# EAGLE schematic MCB-Quectel-BG96-v1.0.0 (EAGLE 7.7.0)

## Sheet 1 of 4
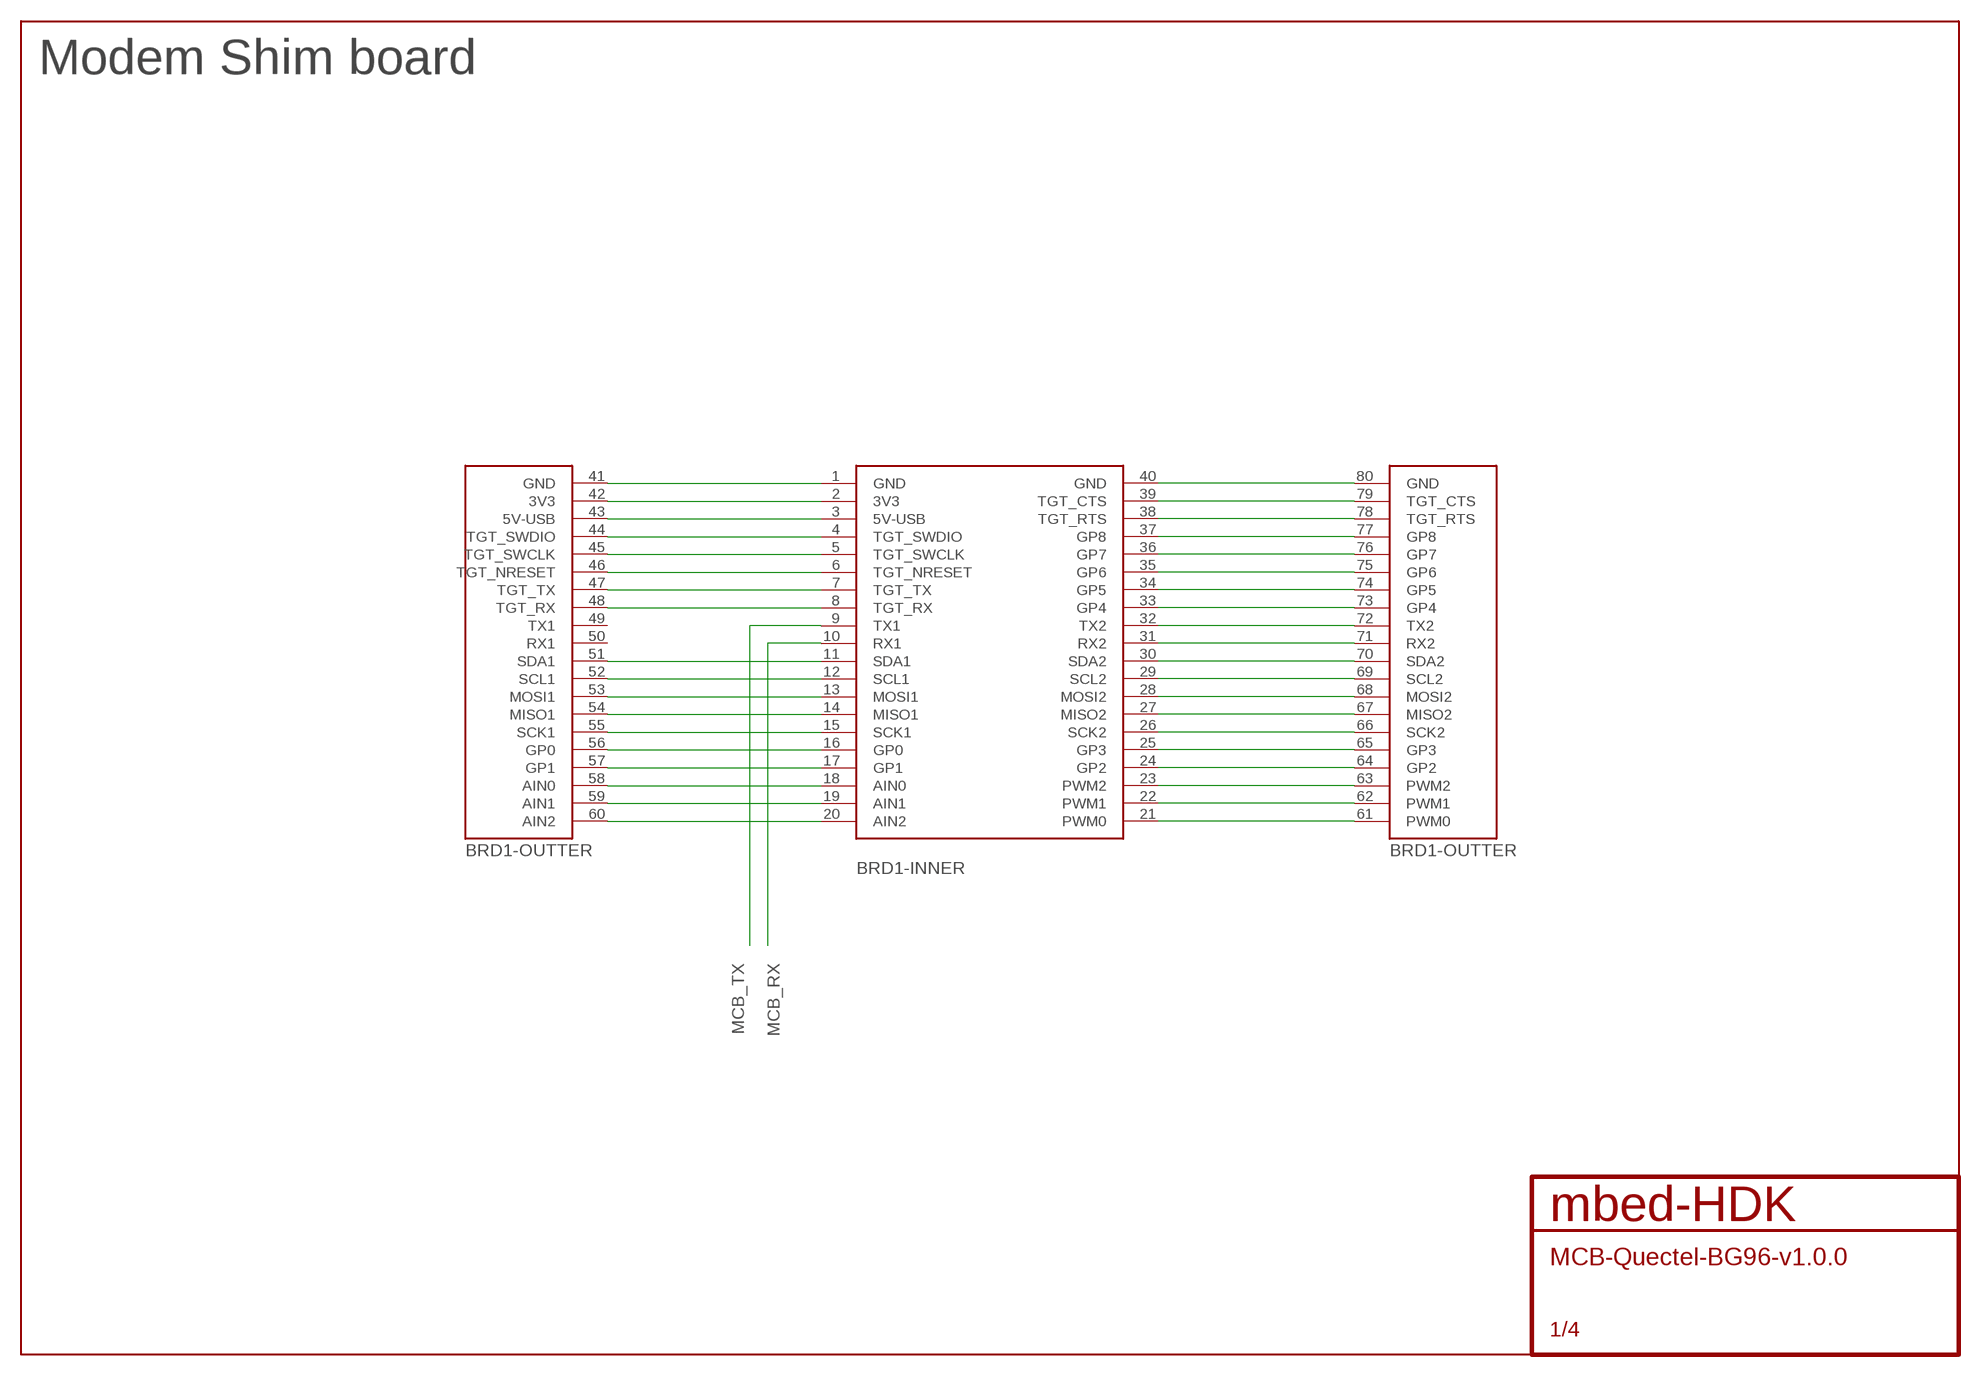
[diagram p0: schematic, sheet 1]

### Parts
BRD1  MODULE-SHIM-BRD  [MODULE-SHIM-BOARD]

### Nets
MCB_RX: BRD1.10(-INNER:RX1)
MCB_TX: BRD1.9(-INNER:TX1)
N$1: BRD1.40(-INNER:GND) BRD1.80(-OUTTER:GND)
N$2: BRD1.39(-INNER:TGT_CTS) BRD1.79(-OUTTER:TGT_CTS)
N$3: BRD1.38(-INNER:TGT_RTS) BRD1.78(-OUTTER:TGT_RTS)
N$4: BRD1.37(-INNER:GP8) BRD1.77(-OUTTER:GP8)
N$5: BRD1.36(-INNER:GP7) BRD1.76(-OUTTER:GP7)
N$6: BRD1.35(-INNER:GP6) BRD1.75(-OUTTER:GP6)
N$7: BRD1.34(-INNER:GP5) BRD1.74(-OUTTER:GP5)
N$8: BRD1.33(-INNER:GP4) BRD1.73(-OUTTER:GP4)
N$9: BRD1.32(-INNER:TX2) BRD1.72(-OUTTER:TX2)
N$10: BRD1.31(-INNER:RX2) BRD1.71(-OUTTER:RX2)
N$11: BRD1.30(-INNER:SDA2) BRD1.70(-OUTTER:SDA2)
N$12: BRD1.29(-INNER:SCL2) BRD1.69(-OUTTER:SCL2)
N$13: BRD1.28(-INNER:MOSI2) BRD1.68(-OUTTER:MOSI2)
N$14: BRD1.27(-INNER:MISO2) BRD1.67(-OUTTER:MISO2)
N$15: BRD1.26(-INNER:SCK2) BRD1.66(-OUTTER:SCK2)
N$16: BRD1.25(-INNER:GP3) BRD1.65(-OUTTER:GP3)
N$17: BRD1.24(-INNER:GP2) BRD1.64(-OUTTER:GP2)
N$18: BRD1.23(-INNER:PWM2) BRD1.63(-OUTTER:PWM2)
N$19: BRD1.22(-INNER:PWM1) BRD1.62(-OUTTER:PWM1)
N$20: BRD1.21(-INNER:PWM0) BRD1.61(-OUTTER:PWM0)
N$21: BRD1.1(-INNER:GND) BRD1.41(-OUTTER:GND)
N$22: BRD1.2(-INNER:3V3) BRD1.42(-OUTTER:3V3)
N$23: BRD1.3(-INNER:5V-USB) BRD1.43(-OUTTER:5V-USB)
N$24: BRD1.4(-INNER:TGT_SWDIO) BRD1.44(-OUTTER:TGT_SWDIO)
N$25: BRD1.5(-INNER:TGT_SWCLK) BRD1.45(-OUTTER:TGT_SWCLK)
N$26: BRD1.6(-INNER:TGT_NRESET) BRD1.46(-OUTTER:TGT_NRESET)
N$27: BRD1.7(-INNER:TGT_TX) BRD1.47(-OUTTER:TGT_TX)
N$28: BRD1.8(-INNER:TGT_RX) BRD1.48(-OUTTER:TGT_RX)
N$31: BRD1.11(-INNER:SDA1) BRD1.51(-OUTTER:SDA1)
N$32: BRD1.12(-INNER:SCL1) BRD1.52(-OUTTER:SCL1)
N$33: BRD1.13(-INNER:MOSI1) BRD1.53(-OUTTER:MOSI1)
N$34: BRD1.14(-INNER:MISO1) BRD1.54(-OUTTER:MISO1)
N$35: BRD1.15(-INNER:SCK1) BRD1.55(-OUTTER:SCK1)
N$36: BRD1.16(-INNER:GP0) BRD1.56(-OUTTER:GP0)
N$37: BRD1.17(-INNER:GP1) BRD1.57(-OUTTER:GP1)
N$38: BRD1.18(-INNER:AIN0) BRD1.58(-OUTTER:AIN0)
N$39: BRD1.19(-INNER:AIN1) BRD1.59(-OUTTER:AIN1)
N$40: BRD1.20(-INNER:AIN2) BRD1.60(-OUTTER:AIN2)
Unconnected: BRD1.49(-OUTTER:TX1) BRD1.50(-OUTTER:RX1)

### Notes on the sheet
- Modem Shim board

## Sheet 2 of 4
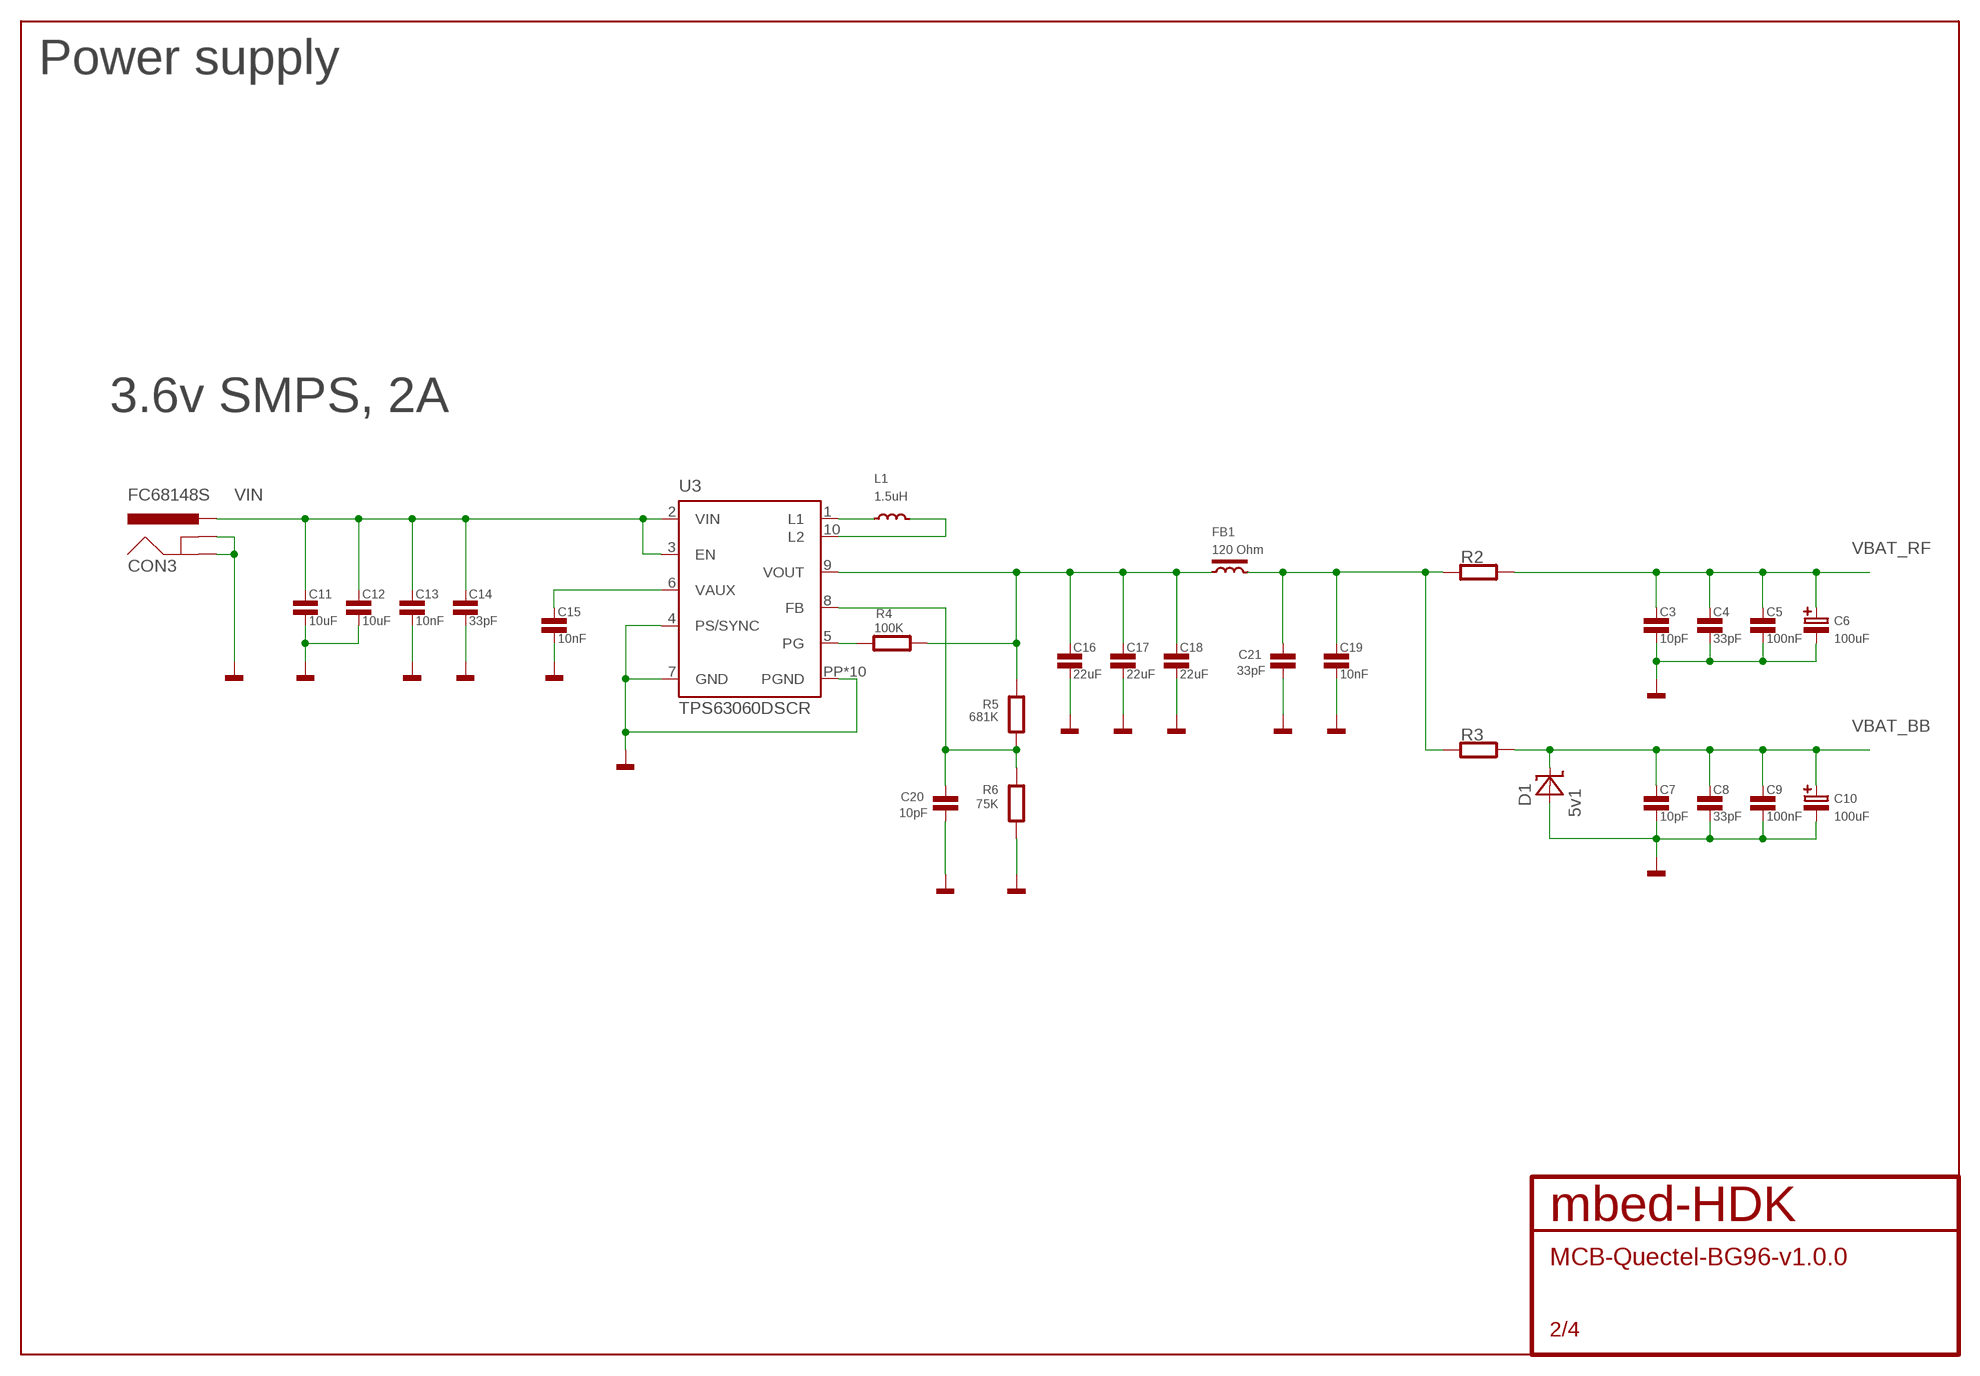
[diagram p1: schematic, sheet 2]

### Parts
C3  10pF  C0603  [0603]
C4  33pF  C0603  [0603]
C5  100nF  C0603  [0603]
C6  100uF  C-POLA  [SMC_A]
C7  10pF  C0603  [0603]
C8  33pF  C0603  [0603]
C9  100nF  C0603  [0603]
C10  100uF  C-POLA  [SMC_A]
C11  10uF  C0603  [0603]
C12  10uF  C0603  [0603]
C13  10nF  C0603  [0603]
C14  33pF  C0603  [0603]
C15  10nF  C0603  [0603]
C16  22uF  C0603  [0603]
C17  22uF  C0603  [0603]
C18  22uF  C0603  [0603]
C19  10nF  C0603  [0603]
C20  10pF  C0603  [0603]
C21  33pF  C0603  [0603]
CON3  FC68148S  [FC68148S]
D1  5v1  DIODE-ZENER  [SOD123]
FB1  120 Ohm  FB0603  [0603]
L1  1.5uH  INDUCTORXFL4020  [XFL4020-472MEC]
R2  R0603  [0603]
R3  R0603  [0603]
R4  100K  R0603  [0603]
R5  681K  R0603  [0603]
R6  75K  R0603  [0603]
U3  TPS63060DSCR  [DSC-S-PWSON-N10]

### Nets
GND: C3.2 C4.2 C5.2 C6.- C7.2 C8.2 C9.2 C10.- C11.2 C12.2 C13.2 C14.2 C15.2 C16.2 C17.2 C18.2 C19.2 C20.2 C21.2 CON3.2(GNDBREAK) CON3.3(GND) D1.1(A) R6.1 U3.4(PS/SYNC) U3.7(GND) U3.PP(PGND) U3.PP@1(PGND) U3.PP@2(PGND) U3.PP@3(PGND) U3.PP@4(PGND) U3.PP@5(PGND) U3.PP@7(PGND) U3.PP@8(PGND) U3.PP@9(PGND) U3.PP@10(PGND) ; also sheet 3
N$41: C15.1 U3.6(VAUX)
N$42: C19.1 C21.1 FB1.2 R2.1 R3.1
N$43: L1.P$1 U3.1(L1)
N$45: L1.P$2 U3.10(L2)
N$46: C16.1 C17.1 C18.1 FB1.1 R4.2 R5.2 U3.9(VOUT)
N$47: R4.1 U3.5(PG)
N$48: C20.1 R5.1 R6.2 U3.8(FB)
VBAT_BB: C7.1 C8.1 C9.1 C10.+ D1.2(C) R3.2 ; also sheet 3
VBAT_RF: C3.1 C4.1 C5.1 C6.+ R2.2 ; also sheet 3
VIN: C11.1 C12.1 C13.1 C14.1 CON3.1-1(PWR) CON3.1-2(PWR) U3.2(VIN) U3.3(EN)

### Notes on the sheet
- Power supply
- 3.6v SMPS, 2A

## Sheet 3 of 4
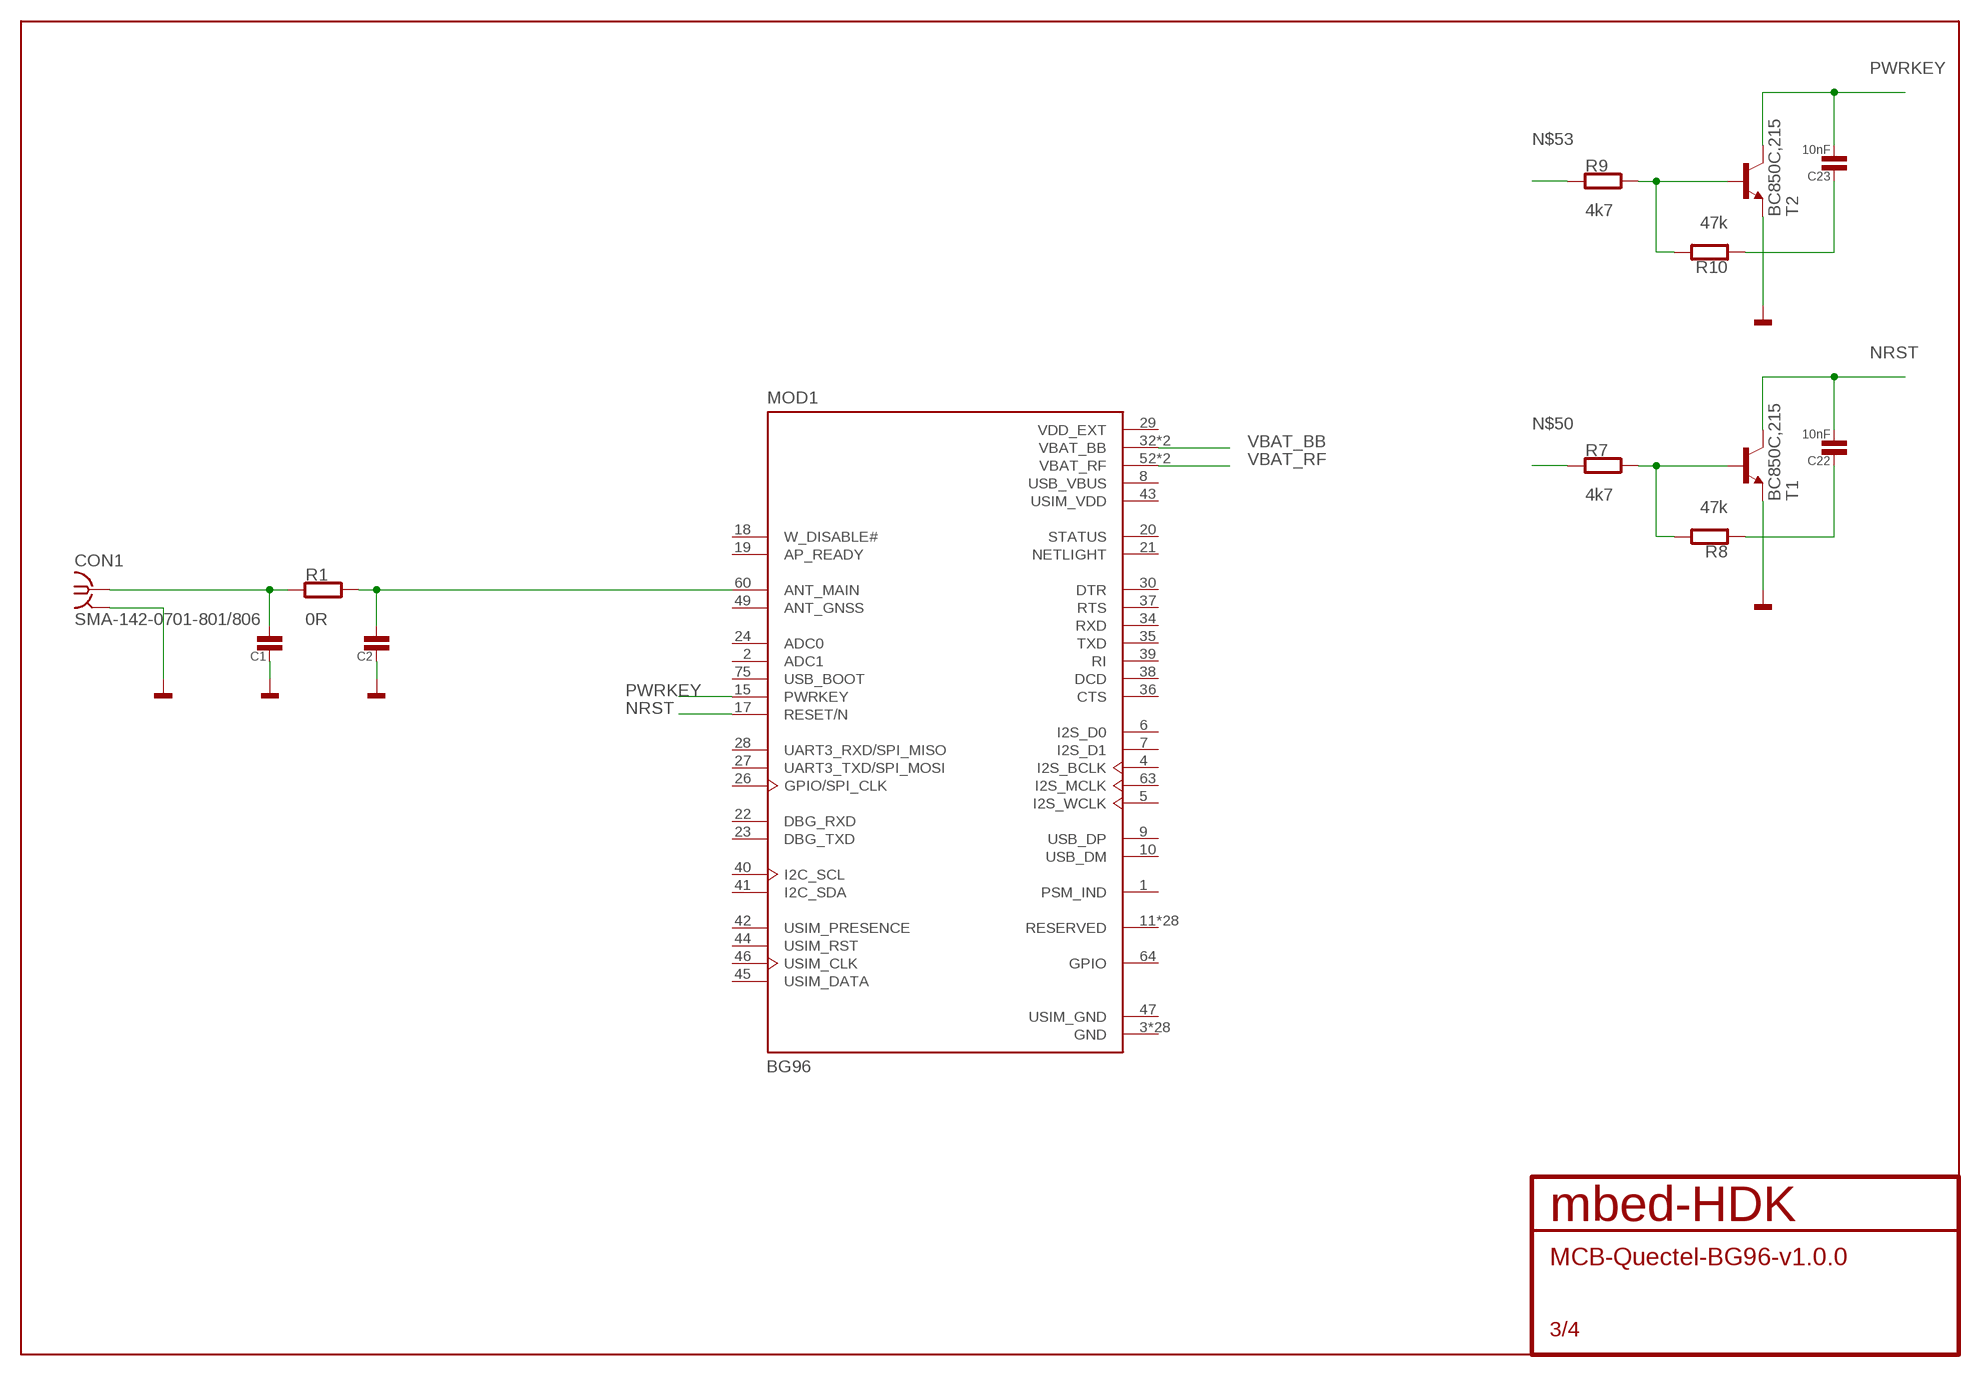
[diagram p2: schematic, sheet 3]

### Parts
C1  C0603  [0603]
C2  C0603  [0603]
C22  10nF  C0603  [0603]
C23  10nF  C0603  [0603]
CON1  SMA-142-0701-801/806  [J502-ND-142-0701-801/806]
MOD1  BG96  [LTE_MODULE_BG96]
R1  0R  R0603  [0603]
R7  4k7  R0603  [0603]
R8  47k  R0603  [0603]
R9  4k7  R0603  [0603]
R10  47k  R0603  [0603]
T1  BC850C,215  [SOT23-3]
T2  BC850C,215  [SOT23-3]

### Nets
GND: C1.1 C2.1 C22.1 C23.1 CON1.G@1 CON1.G@2 CON1.G@3 CON1.G@4 R8.1 R10.1 T1.2(E) T2.2(E) ; also sheet 2
N$29: C1.2 CON1.1 R1.1
N$30: C2.2 MOD1.60(ANT_MAIN) R1.2
N$49: R7.2 R8.2 T1.1(B)
N$50: R7.1
N$52: R9.2 R10.2 T2.1(B)
N$53: R9.1
NRST: C22.2 MOD1.17(RESET/N) T1.3(C)
PWRKEY: C23.2 MOD1.15(PWRKEY) T2.3(C)
VBAT_BB: MOD1.32(VBAT_BB) MOD1.33(VBAT_BB) ; also sheet 2
VBAT_RF: MOD1.52(VBAT_RF) MOD1.53(VBAT_RF) ; also sheet 2
Unconnected: MOD1.1(PSM_IND) MOD1.2(ADC1) MOD1.4(I2S_BCLK) MOD1.5(I2S_WCLK) MOD1.6(I2S_D0) MOD1.7(I2S_D1) MOD1.9(USB_DP) MOD1.10(USB_DM) MOD1.11(RESERVED) MOD1.12(RESERVED) MOD1.13(RESERVED) MOD1.14(RESERVED) MOD1.16(RESERVED) MOD1.18(W_DISABLE#) MOD1.19(AP_READY) MOD1.20(STATUS) MOD1.21(NETLIGHT) MOD1.22(DBG_RXD) MOD1.23(DBG_TXD) MOD1.24(ADC0) MOD1.25(RESERVED) MOD1.26(GPIO/SPI_CLK) MOD1.27(UART3_TXD/SPI_MOSI) MOD1.28(UART3_RXD/SPI_MISO) MOD1.30(DTR) MOD1.34(RXD) MOD1.35(TXD) MOD1.36(CTS) MOD1.37(RTS) MOD1.38(DCD) MOD1.39(RI) MOD1.40(I2C_SCL) MOD1.41(I2C_SDA) MOD1.42(USIM_PRESENCE) MOD1.44(USIM_RST) MOD1.45(USIM_DATA) MOD1.46(USIM_CLK) MOD1.49(ANT_GNSS) MOD1.51(RESERVED) MOD1.56(RESERVED) MOD1.57(RESERVED) MOD1.63(I2S_MCLK) MOD1.64(GPIO) MOD1.65(RESERVED) MOD1.66(RESERVED) MOD1.75(USB_BOOT) MOD1.76(RESERVED) MOD1.77(RESERVED) MOD1.78(RESERVED) MOD1.83(RESERVED) MOD1.84(RESERVED) MOD1.85(RESERVED) MOD1.86(RESERVED) MOD1.87(RESERVED) MOD1.88(RESERVED) MOD1.92(RESERVED) MOD1.93(RESERVED) MOD1.94(RESERVED) MOD1.95(RESERVED) MOD1.96(RESERVED) MOD1.97(RESERVED) MOD1.98(RESERVED) MOD1.99(RESERVED)

## Sheet 4 of 4
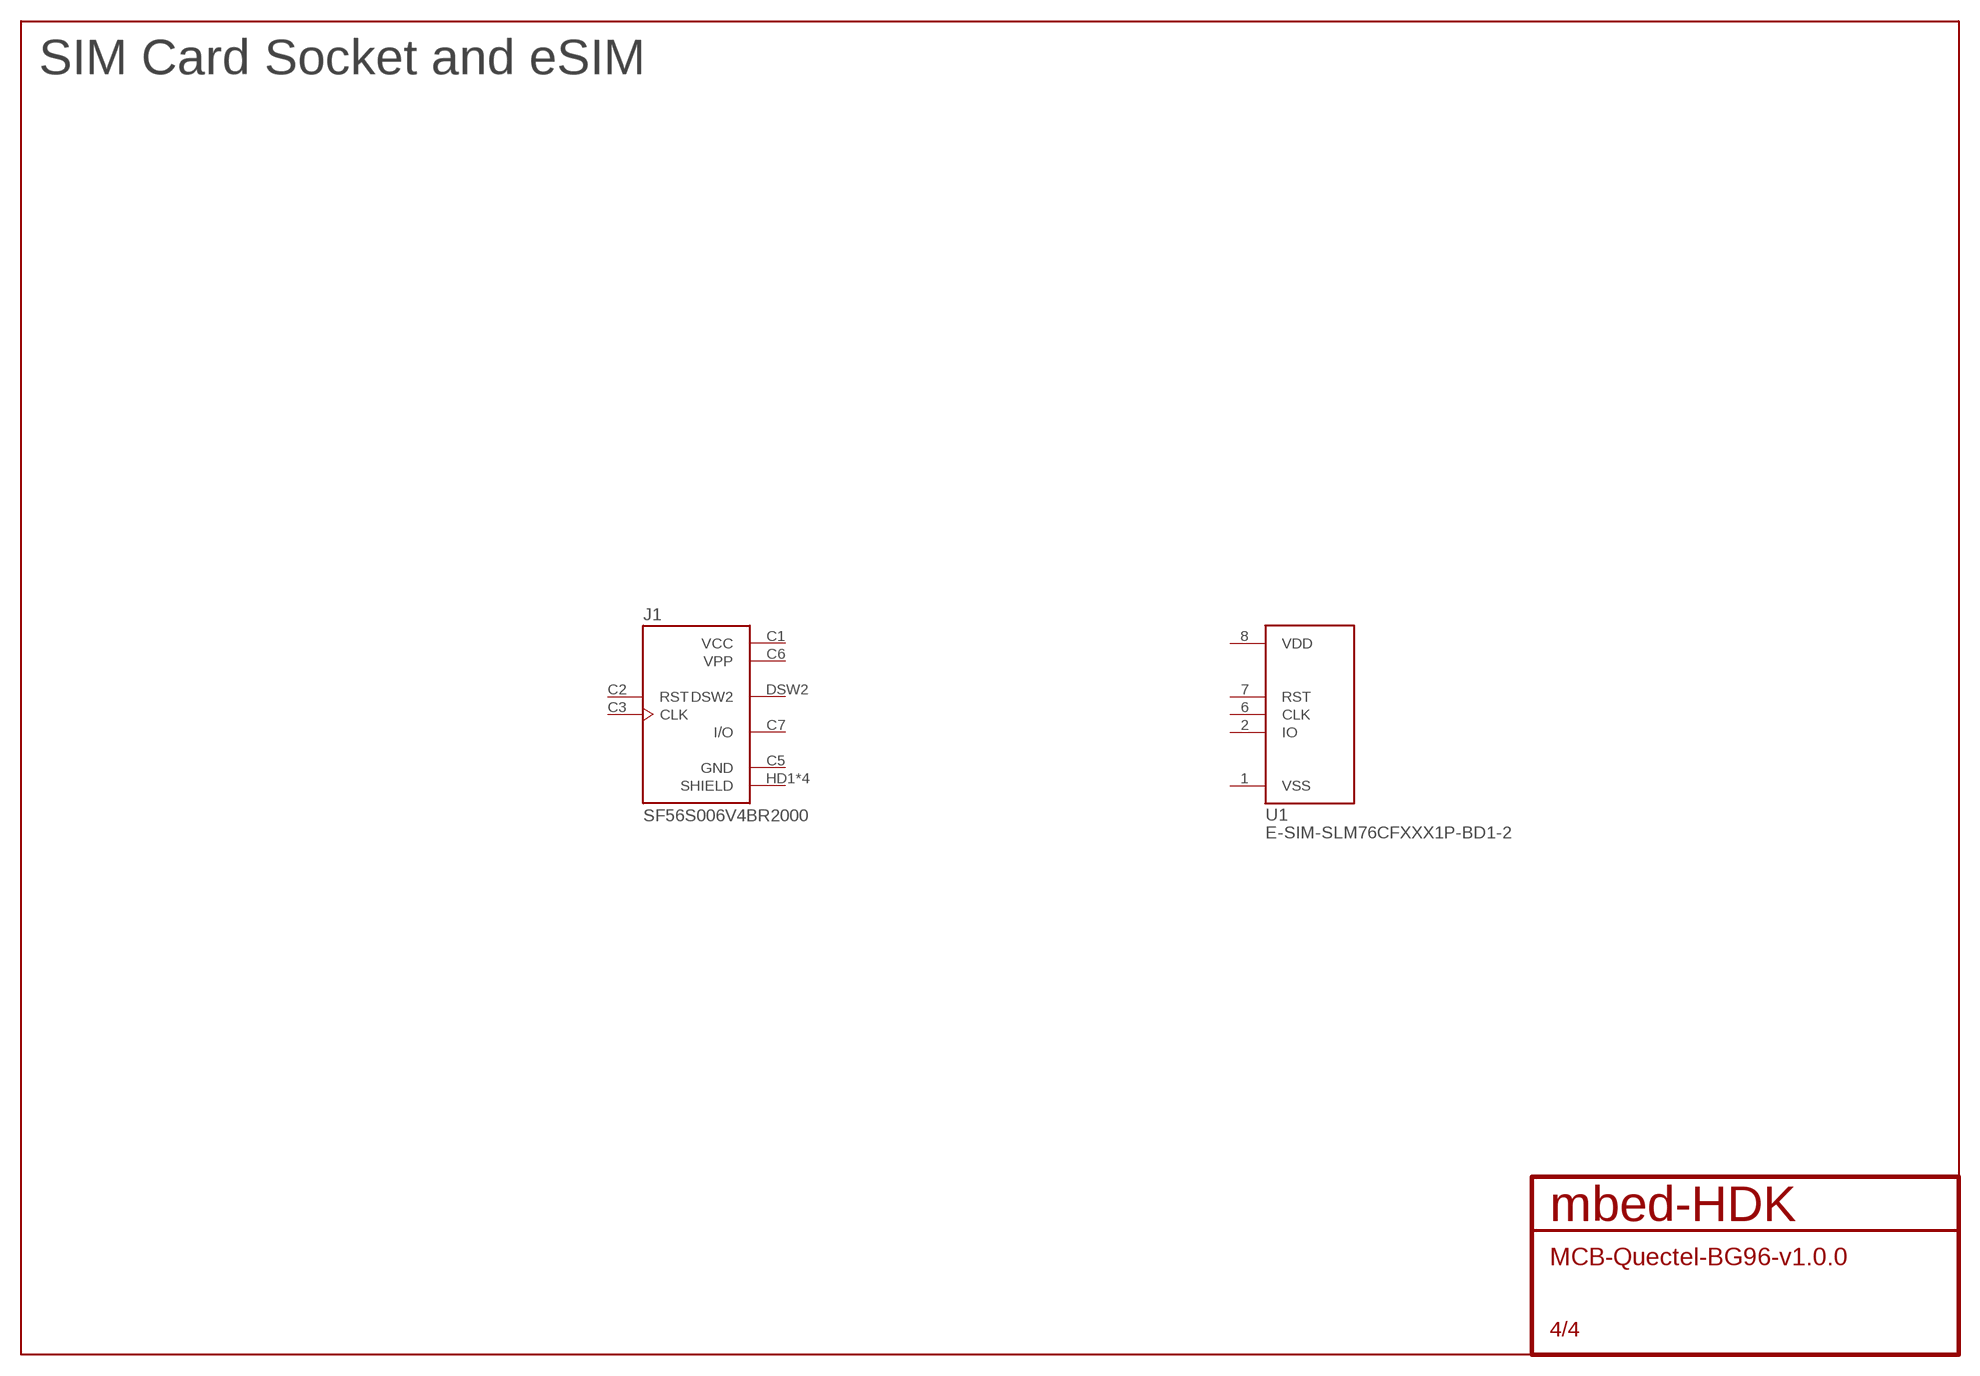
[diagram p3: schematic, sheet 4]

### Parts
J1  SF56S006V4BR2000  [JAE_SF56S006V4BR2000]
U1  E-SIM-SLM76CFXXX1P-BD1-2  [VQFN-8-1]
Unconnected: J1.C2(RST) J1.C3(CLK) J1.C7(I/O) J1.DSW2 U1.1(VSS) U1.2(IO) U1.6(CLK) U1.7(RST) U1.8(VDD)

### Notes on the sheet
- SIM Card Socket and eSIM

## Power pins joined to a net without a drawn wire
GND: J1.C5(GND) MOD1.3(GND) MOD1.31(GND) MOD1.48(GND) MOD1.50(GND) MOD1.54(GND) MOD1.55(GND) MOD1.58(GND) MOD1.59(GND) MOD1.61(GND) MOD1.62(GND) MOD1.67(GND) MOD1.68(GND) MOD1.69(GND) MOD1.70(GND) MOD1.71(GND) MOD1.72(GND) MOD1.73(GND) MOD1.74(GND) MOD1.79(GND) MOD1.80(GND) MOD1.81(GND) MOD1.82(GND) MOD1.89(GND) MOD1.90(GND) MOD1.91(GND) MOD1.100(GND) MOD1.101(GND) MOD1.102(GND)
SHIELD: J1.HD1(SHIELD) J1.HD2,DSW1(SHIELD) J1.HD3(SHIELD) J1.HD4(SHIELD)
USB_VBUS: MOD1.8(USB_VBUS)
USIM_GND: MOD1.47(USIM_GND)
USIM_VDD: MOD1.43(USIM_VDD)
VCC: J1.C1(VCC)
VDD_EXT: MOD1.29(VDD_EXT)
VPP: J1.C6(VPP)

## Library data of the parts
BRD1 = mbed-HDK-misc-Board:MODULE-SHIM
C1-C5 C7-C9 C11-C23 = mbed-HDK-RLC:C: Capacitor
C6 C10 = mbed-HDK-RLC:C-POL: Polarised capacitor
CON1 = mbed-HDK-Connector:SMA-: SMA 50 Ohm End Launch Jack Receptacle - Round Contact Johnson Components Source: www.johnsoncomponents.com .. J502-ND.pdf; MF: JOHNSON COMPONENTS; MPN: 142-0701-801; OC_FARNELL: 1608592; OC_NEWARK: 90F2624
CON3 = mbed-HDK-Connector:FC68148S: Power Jack This is the standard 5.5mm barrel jack for power. The PTH is the most common, proven, reliable, footprint. The Slot footprint only works if the mill layer is transmitted to the PCB fab house so be warned. Mating wall wart : TOL-00298 (and others); MF: Cliff; MFN: FC68148S; OC_NEWARK: 1889309
D1 = mbed-HDK-Discrete:DIODE-ZENER
FB1 = mbed-HDK-RLC:FB: Ferrite Bead
J1 = SnapEDA:SF56S006V4BR2000: CONN MICRO SIM CARD PUSH-PUSH; DESCRIPTION: SF56 series, micro-SIM card connector, push-push type, normal closed; DIGI-KEY_PART_NUMBER: 670-2834-1-ND; DIGI-KEY_PURCHASE_URL: https://www.digikey.co.uk/product-detail/en/jae-electronics/SF56S006V4BR2000/670-2834-1-ND/5280152?utm_source=snapeda&utm_medium=aggregator&utm_campaign=symbol; MF: JAE Electronics; MP: SF56S006V4BR2000; PACKAGE: None
L1 = mbed-HDK-RLC:INDUCTOR: Inductor; MF: CoilCraft; MFN: XFL4020-472MEC; OC-NEWARK: 2289218
MOD1 = SnapEDA:BG96: Lte Cat.M1 Module For Global Sku; AVAILABILITY: Unavailable; DESCRIPTION: Lte Cat.M1 Module For Global Sku; MF: Quectel; MP: BG96; PACKAGE: None; PRICE: 124.49 USD
R1-R10 = mbed-HDK-RLC:R: Resistor
T1 T2 = mbed-HDK-Discrete:BC850C,215: BJT NPN; DIGIKEY-OC: 568-6077-1-ND; MF: NXP Semiconductors; MFN: BC850C,215; MOUSER-OC: 771-BC850C-T/R; NEWARK-OC: 75R0745
U1 = mbed-HDK-IC:E-SIM
U3 = mbed-HDK-Power:TPS63060DSCR: Buck Boost Conveter (2.5V-12Vin, 2.5V-8Vout, 2Aout); MF: TEXAS INSTRUMENTS; MFN: TPS63060DSCR; OC-DIGIKEY: 296-30204-1-ND; OC-MOUSER: 595-TPS63060DSCR; OC-NEWARK: 76T8143